# EAGLE design BMS Enerdel Adapter rev8 (EAGLE 9.6.2)
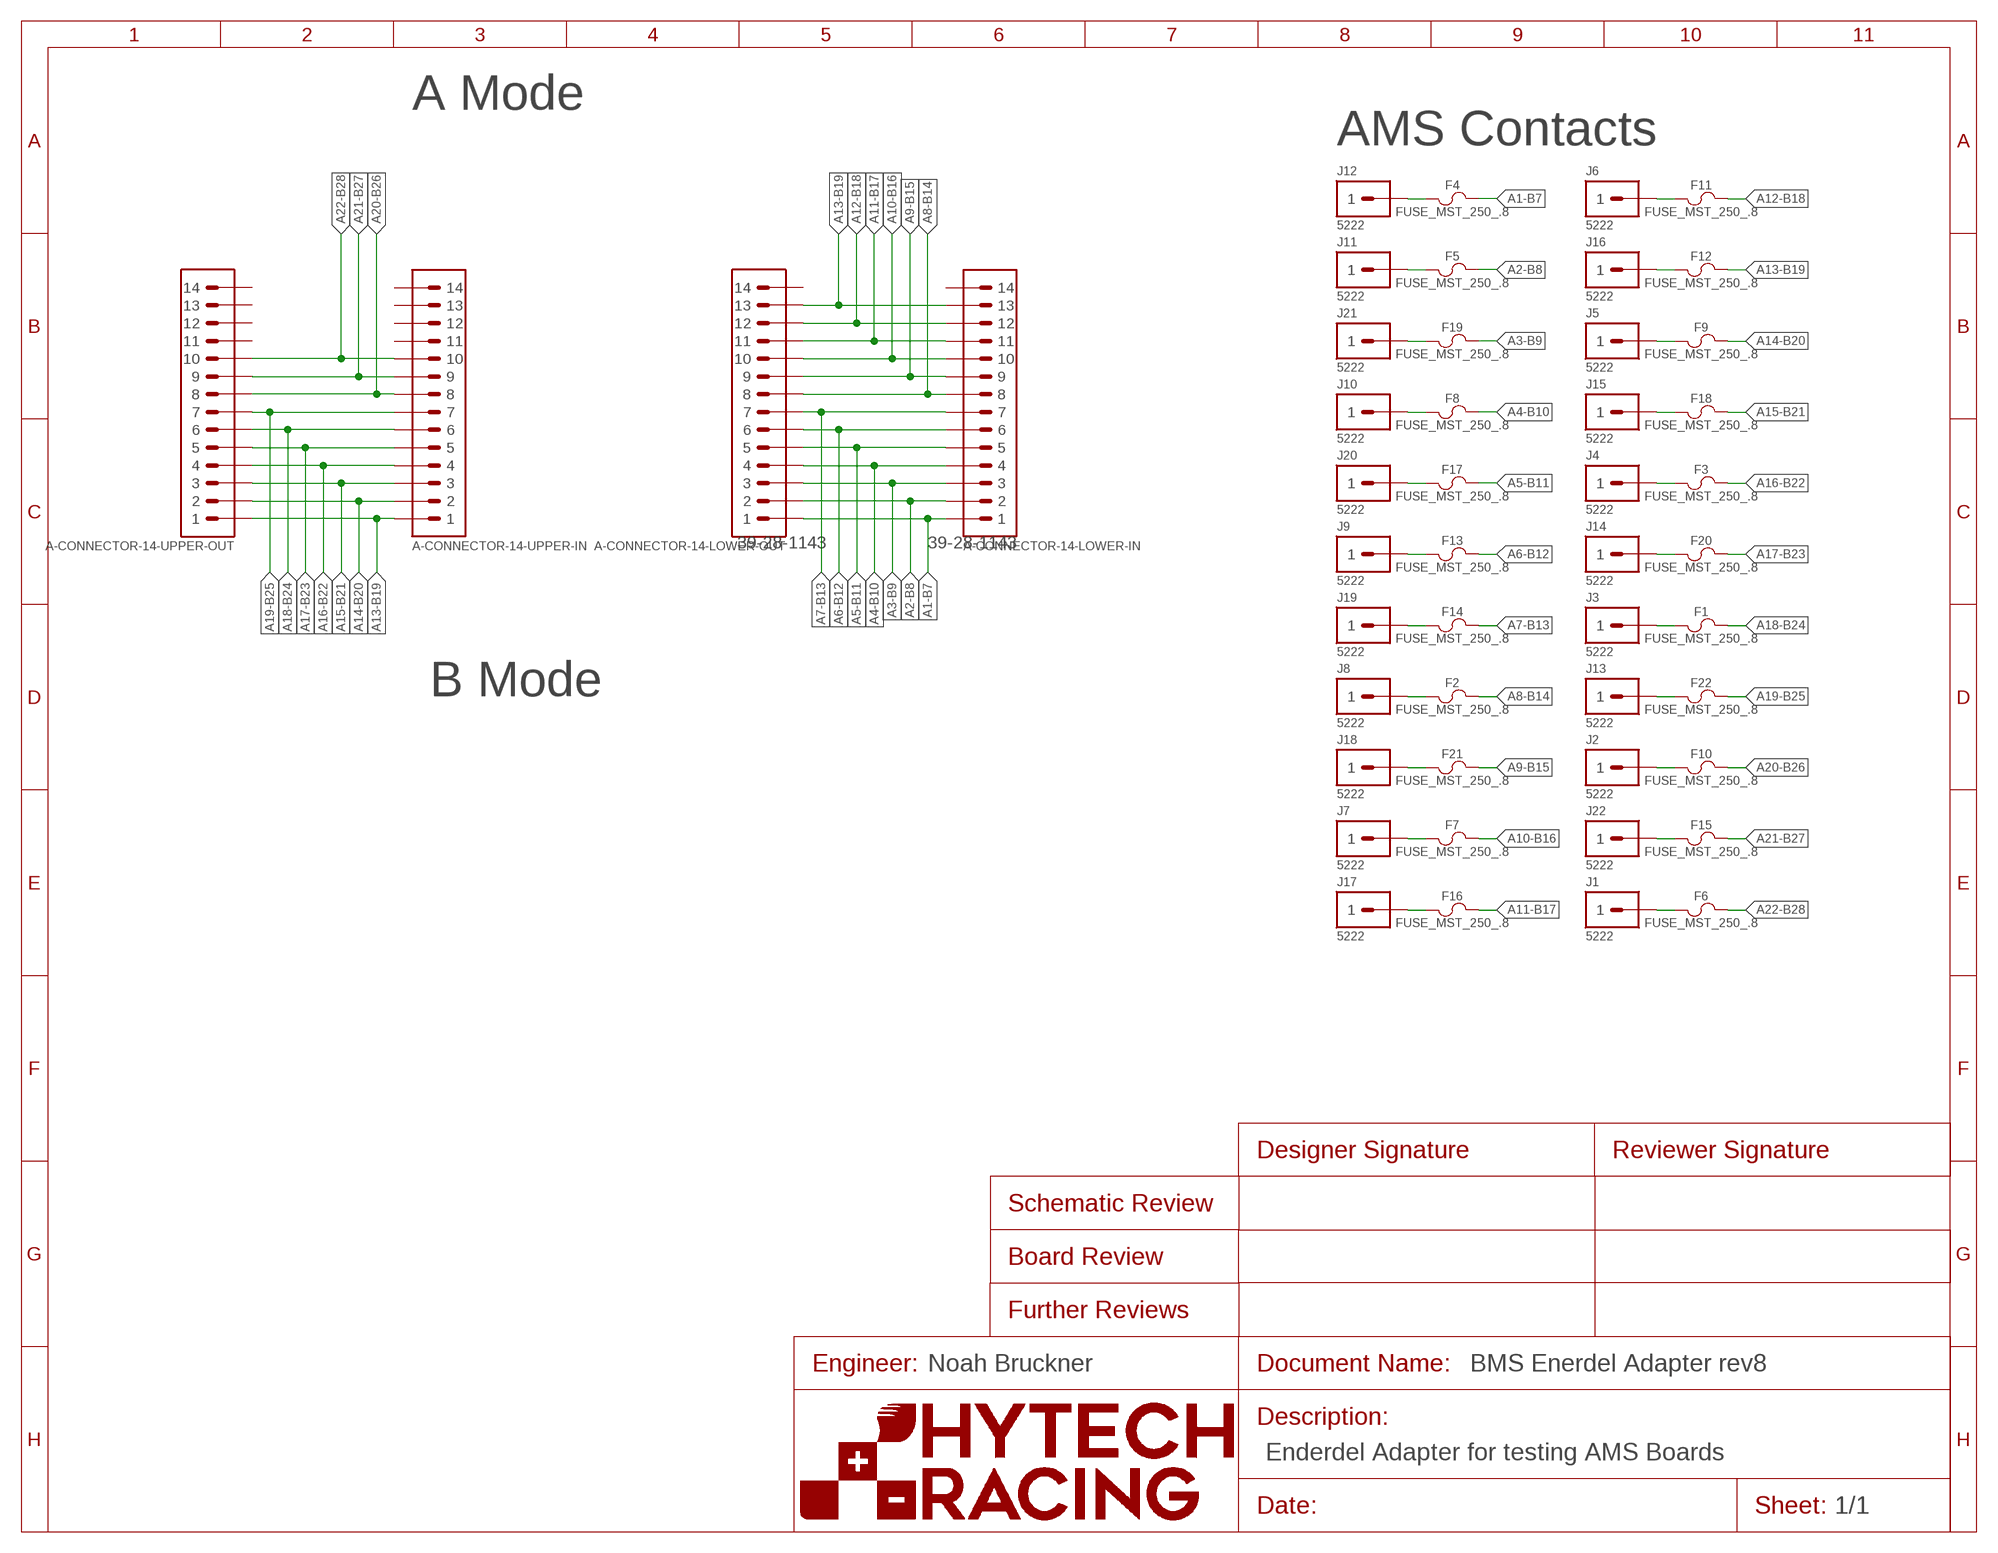
[diagram p0: schematic, sheet 1]

## Parts
A-CONNECTOR-14-LOWER-IN  CONNECTOR-14_MINIFIT_  [MOLEX_MINIFIT_PTH_14]
A-CONNECTOR-14-LOWER-OUT  CONNECTOR-14_MINIFIT_  [MOLEX_MINIFIT_PTH_14]
A-CONNECTOR-14-UPPER-IN  CONNECTOR-14_NANOFIT_  [MOLEX_NANOFIT_PTH_14]
A-CONNECTOR-14-UPPER-OUT  CONNECTOR-14_NANOFIT_  [MOLEX_NANOFIT_PTH_14]
F1  FUSE_MST_250_.8  [MST_250]
F2  FUSE_MST_250_.8  [MST_250]
F3  FUSE_MST_250_.8  [MST_250]
F4  FUSE_MST_250_.8  [MST_250]
F5  FUSE_MST_250_.8  [MST_250]
F6  FUSE_MST_250_.8  [MST_250]
F7  FUSE_MST_250_.8  [MST_250]
F8  FUSE_MST_250_.8  [MST_250]
F9  FUSE_MST_250_.8  [MST_250]
F10  FUSE_MST_250_.8  [MST_250]
F11  FUSE_MST_250_.8  [MST_250]
F12  FUSE_MST_250_.8  [MST_250]
F13  FUSE_MST_250_.8  [MST_250]
F14  FUSE_MST_250_.8  [MST_250]
F15  FUSE_MST_250_.8  [MST_250]
F16  FUSE_MST_250_.8  [MST_250]
F17  FUSE_MST_250_.8  [MST_250]
F18  FUSE_MST_250_.8  [MST_250]
F19  FUSE_MST_250_.8  [MST_250]
F20  FUSE_MST_250_.8  [MST_250]
F21  FUSE_MST_250_.8  [MST_250]
F22  FUSE_MST_250_.8  [MST_250]
J1  CONNECTOR-1_5222_  [5222]
J2  CONNECTOR-1_5222_  [5222]
J3  CONNECTOR-1_5222_  [5222]
J4  CONNECTOR-1_5222_  [5222]
J5  CONNECTOR-1_5222_  [5222]
J6  CONNECTOR-1_5222_  [5222]
J7  CONNECTOR-1_5222_  [5222]
J8  CONNECTOR-1_5222_  [5222]
J9  CONNECTOR-1_5222_  [5222]
J10  CONNECTOR-1_5222_  [5222]
J11  CONNECTOR-1_5222_  [5222]
J12  CONNECTOR-1_5222_  [5222]
J13  CONNECTOR-1_5222_  [5222]
J14  CONNECTOR-1_5222_  [5222]
J15  CONNECTOR-1_5222_  [5222]
J16  CONNECTOR-1_5222_  [5222]
J17  CONNECTOR-1_5222_  [5222]
J18  CONNECTOR-1_5222_  [5222]
J19  CONNECTOR-1_5222_  [5222]
J20  CONNECTOR-1_5222_  [5222]
J21  CONNECTOR-1_5222_  [5222]
J22  CONNECTOR-1_5222_  [5222]

## Nets
A1-B7: A-CONNECTOR-14-LOWER-IN.1 A-CONNECTOR-14-LOWER-OUT.1 F4.2
A2-B8: A-CONNECTOR-14-LOWER-IN.2 A-CONNECTOR-14-LOWER-OUT.2 F5.2
A3-B9: A-CONNECTOR-14-LOWER-IN.3 A-CONNECTOR-14-LOWER-OUT.3 F19.2
A4-B10: A-CONNECTOR-14-LOWER-IN.4 A-CONNECTOR-14-LOWER-OUT.4 F8.2
A5-B11: A-CONNECTOR-14-LOWER-IN.5 A-CONNECTOR-14-LOWER-OUT.5 F17.2
A6-B12: A-CONNECTOR-14-LOWER-IN.6 A-CONNECTOR-14-LOWER-OUT.6 F13.2
A7-B13: A-CONNECTOR-14-LOWER-IN.7 A-CONNECTOR-14-LOWER-OUT.7 F14.2
A8-B14: A-CONNECTOR-14-LOWER-IN.8 A-CONNECTOR-14-LOWER-OUT.8 F2.2
A9-B15: A-CONNECTOR-14-LOWER-IN.9 A-CONNECTOR-14-LOWER-OUT.9 F21.2
A10-B16: A-CONNECTOR-14-LOWER-IN.10 A-CONNECTOR-14-LOWER-OUT.10 F7.2
A11-B17: A-CONNECTOR-14-LOWER-IN.11 A-CONNECTOR-14-LOWER-OUT.11 F16.2
A12-B18: A-CONNECTOR-14-LOWER-IN.12 A-CONNECTOR-14-LOWER-OUT.12 F11.2
A13-B19: A-CONNECTOR-14-LOWER-IN.13 A-CONNECTOR-14-LOWER-OUT.13 A-CONNECTOR-14-UPPER-IN.1 A-CONNECTOR-14-UPPER-OUT.1 F12.2
A14-B20: A-CONNECTOR-14-UPPER-IN.2 A-CONNECTOR-14-UPPER-OUT.2 F9.2
A15-B21: A-CONNECTOR-14-UPPER-IN.3 A-CONNECTOR-14-UPPER-OUT.3 F18.2
A16-B22: A-CONNECTOR-14-UPPER-IN.4 A-CONNECTOR-14-UPPER-OUT.4 F3.2
A17-B23: A-CONNECTOR-14-UPPER-IN.5 A-CONNECTOR-14-UPPER-OUT.5 F20.2
A18-B24: A-CONNECTOR-14-UPPER-IN.6 A-CONNECTOR-14-UPPER-OUT.6 F1.2
A19-B25: A-CONNECTOR-14-UPPER-IN.7 A-CONNECTOR-14-UPPER-OUT.7 F22.2
A20-B26: A-CONNECTOR-14-UPPER-IN.8 A-CONNECTOR-14-UPPER-OUT.8 F10.2
A21-B27: A-CONNECTOR-14-UPPER-IN.9 A-CONNECTOR-14-UPPER-OUT.9 F15.2
A22-B28: A-CONNECTOR-14-UPPER-IN.10 A-CONNECTOR-14-UPPER-OUT.10 F6.2
N$1: F4.1 J12.1
N$2: F5.1 J11.1
N$3: F19.1 J21.1
N$4: F8.1 J10.1
N$8: F17.1 J20.1
N$9: F13.1 J9.1
N$10: F14.1 J19.1
N$11: F2.1 J8.1
N$12: F21.1 J18.1
N$13: F7.1 J7.1
N$14: F16.1 J17.1
N$15: F6.1 J1.1
N$16: F15.1 J22.1
N$17: F10.1 J2.1
N$18: F22.1 J13.1
N$19: F1.1 J3.1
N$20: F20.1 J14.1
N$21: F3.1 J4.1
N$22: F18.1 J15.1
N$23: F9.1 J5.1
N$24: F11.1 J6.1
N$25: F12.1 J16.1
Unconnected: A-CONNECTOR-14-LOWER-IN.14 A-CONNECTOR-14-LOWER-OUT.14 A-CONNECTOR-14-UPPER-IN.11 A-CONNECTOR-14-UPPER-IN.12 A-CONNECTOR-14-UPPER-IN.13 A-CONNECTOR-14-UPPER-IN.14 A-CONNECTOR-14-UPPER-OUT.11 A-CONNECTOR-14-UPPER-OUT.12 A-CONNECTOR-14-UPPER-OUT.13 A-CONNECTOR-14-UPPER-OUT.14

## Notes on the sheet
- A Mode
- AMS Contacts
- B Mode
- Noah Bruckner
- Enderdel Adapter for testing AMS Boards

## Library data of the parts
A-CONNECTOR-14-LOWER-IN A-CONNECTOR-14-LOWER-OUT = HyTechDevices:CONNECTOR-14_?_*; MPN: 39-28-1143
A-CONNECTOR-14-UPPER-IN A-CONNECTOR-14-UPPER-OUT = HyTechDevices:CONNECTOR-14_?_*
F1-F22 = HyTechDevices:FUSE_?_*: Fuse 0885 Series <https://www.mouser.com/datasheet/2/240/Littelfuse_Fuse_885_Datasheet_pdf-1371443.pdf> MST 250 Series <https://www.mouser.com/datasheet/2/358/typ_MST_250-1772502.pdf>; CURRENT: 800mA; DKPN: 486-1470-ND; FUSE_TYPE: THT; MANUFACTURER: Schurter Inc.; MOPN: 693-0034.6614; MPN: 0034.6614; VOLTAGE: 63V
J1-J22 = HyTechDevices:CONNECTOR-1_?_*: 1 Pin Connector Pogo pin datasheet <https://www.mouser.com/datasheet/2/273/Mill-Max_03212019_807-22-001-10-020101-1545127.pdf> 5222 Spring datasheet <https://www.mouser.com/datasheet/2/215/5222-743174.pdf>; DKPN: 36-5222-ND; MANUFACTURER: Keystone Electronics; MODEL: SPRING; MOPN: 534-5222; MPN: 5222

## Board
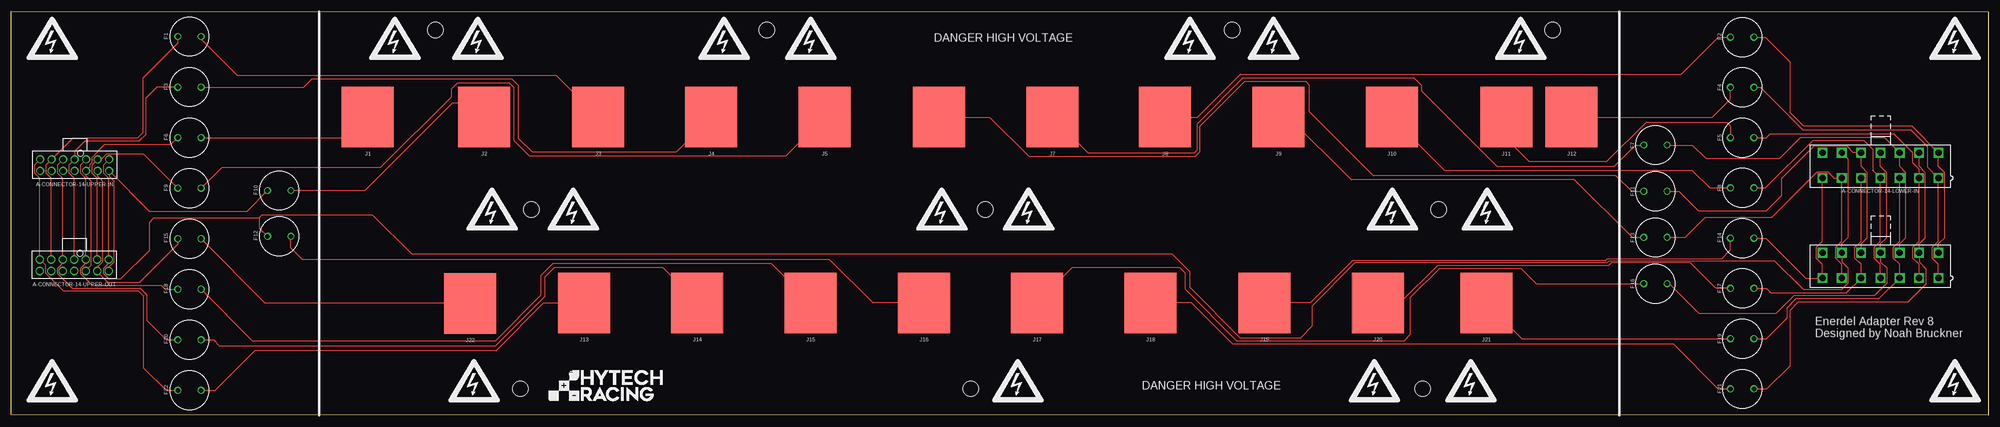
[diagram p1: board, top side]

Size 429.79 x 87.73 mm. Coordinates in mm from the lower left corner, seen from the top.
Outline: 0,0.1 0,87.73 429.79,87.63 429.79,0 0,0.1
Copper layers (1*16): Top 0.035mm / dielectric 1.53mm / Bottom 0.035mm
Design rules "HyTech Default (2 Layer)": minimum track width 8mil, minimum drill 0.3mm, track to track 8mil, track to pad 8mil, pad to pad 8mil, via to via 22mil, smd to smd 8mil, copper to edge 17mil, drill to drill 23mil, minimum pad ring 9mil, minimum via ring 8mil, stop-mask expansion 8mil, vias tented up to drill 30mil, thermal gap 10mil

### Footprints (pad centres in the part's own frame; a part is rotated, then mirrored left to right if it is on the bottom)
MOLEX_MINIFIT_PTH_14 = drill 1.4 square: 1 12.6,-2.75; 2 8.4,-2.75; 3 4.2,-2.75; 4 0,-2.75; 5 -4.2,-2.75; 6 -8.4,-2.75; 7 -12.6,-2.75; 8 12.6,2.75; 9 8.4,2.75; 10 4.2,2.75; 11 0,2.75; 12 -4.2,2.75; 13 -8.4,2.75; 14 -12.6,2.75
MOLEX_NANOFIT_PTH_14 = drill 1.2: 1 7.5,0; 2 5,0; 3 2.5,0; 4 0,0; 5 -2.5,0; 6 -5,0; 7 -7.5,0; 8 7.5,-2.5; 9 5,-2.5; 10 2.5,-2.5; 11 0,-2.5; 12 -2.5,-2.5; 13 -5,-2.5; 14 -7.5,-2.5 | hole 1.3: 1.27,1.34
MST_250 = drill 1: 1 -2.54,0; 2 2.54,0
5222 = smd 11.303 x 13.208: 1 0,0
MOUNTING_M3 = hole 3.4: 0,0

### Placement (x,y rotation side)
A-CONNECTOR-14-LOWER-IN  406.4,54.28 0 top
A-CONNECTOR-14-LOWER-OUT  406.4,32.54 0 top
A-CONNECTOR-14-UPPER-IN  13.74,55.59 0 top
A-CONNECTOR-14-UPPER-OUT  13.64,33.85 0 top
F1  38.7,82.29 180 top
F2  376.34,82.17 0 top
F3  38.7,71.3 180 top
F4  376.34,71.24 0 top
F5  376.34,60.31 0 top
F6  38.7,60.31 180 top
F7  357.48,58.71 0 top
F8  376.34,49.39 0 top
F9  38.7,49.32 180 top
F10  58.22,48.83 180 top
F11  357.48,48.66 0 top
F12  58.22,38.86 180 top
F13  357.48,38.62 0 top
F14  376.34,38.46 0 top
F15  38.7,38.33 180 top
F16  357.48,28.57 0 top
F17  376.34,27.53 0 top
F18  38.7,27.35 180 top
F19  376.34,16.61 0 top
F20  38.7,16.36 180 top
F21  376.34,5.68 0 top
F22  38.7,5.37 180 top
J1  77.5,64.77 180 top
J2  102.77,64.77 180 top
J3  127.53,64.77 180 top
J4  152.17,64.77 180 top
J5  176.81,64.77 180 top
J6  201.7,64.77 180 top
J7  226.34,64.77 180 top
J8  250.85,64.77 180 top
J9  275.49,64.77 180 top
J10  300.13,64.77 180 top
J11  325.02,64.77 180 top
J12  339.24,64.77 180 top
J13  124.49,24.38 180 top
J14  149.12,24.38 180 top
J15  173.76,24.38 180 top
J16  198.4,24.38 180 top
J17  223.04,24.38 180 top
J18  247.68,24.38 180 top
J19  272.44,24.38 180 top
J20  297.08,24.38 180 top
J21  320.7,24.38 180 top
J22  99.72,24.26 180 top
U$1  [HV_LARGE]  8.86,81.9 0 top
U$2  [HV_LARGE]  83.39,81.9 0 top
U$3  [HV_LARGE]  101.42,81.9 0 top
U$4  [HV_LARGE]  154.97,81.9 0 top
U$5  [HV_LARGE]  173.81,81.9 0 top
U$6  [HV_LARGE]  256.29,81.9 0 top
U$7  [HV_LARGE]  274.45,81.9 0 top
U$8  [HV_LARGE]  328.19,81.9 0 top
U$9  [HV_LARGE]  422.63,81.9 0 top
U$10  [HV_LARGE]  104.52,44.76 0 top
U$11  [HV_LARGE]  122.17,44.76 0 top
U$12  [HV_LARGE]  202.31,44.76 0 top
U$13  [HV_LARGE]  221.18,44.76 0 top
U$14  [HV_LARGE]  300.3,44.76 0 top
U$15  [HV_LARGE]  320.93,44.76 0 top
U$16  [MOUNTING_M3]  92.15,83.69 0 top
U$17  [HV_LARGE]  8.86,7.47 0 top
U$18  [HV_LARGE]  100.61,7.47 0 top
U$19  [HV_LARGE]  218.85,7.47 0 top
U$20  [HV_LARGE]  296.39,7.47 0 top
U$21  [HV_LARGE]  317.37,7.47 0 top
U$22  [HV_LARGE]  422.63,7.47 0 top
U$23  [LOGO_HYTECH_1.0"]  116.54,2.78 0 top
U$24  [MOUNTING_M3]  164.24,83.69 0 top
U$25  [MOUNTING_M3]  265.46,83.69 0 top
U$26  [MOUNTING_M3]  335.1,83.69 0 top
U$27  [MOUNTING_M3]  113.06,44.7 0 top
U$28  [MOUNTING_M3]  211.73,44.7 0 top
U$29  [MOUNTING_M3]  310.29,44.7 0 top
U$30  [MOUNTING_M3]  110.64,5.72 0 top
U$31  [MOUNTING_M3]  208.56,5.72 0 top
U$32  [MOUNTING_M3]  306.86,5.72 0 top

### Tracks (layer width: path | path; a pad name or v marks a point on that pad's centre or on a via)
A1-B7
  Top 0.203: A-CONNECTOR-14-LOWER-OUT.1 419,32.76 417.64,34.11 417.64,36.46 419,37.82 A-CONNECTOR-14-LOWER-IN.1 416.66,53.87 416.66,58.32 412.99,61.99 389.51,61.99 380.26,71.24 F4.2
A2-B8
  Top 0.203: A-CONNECTOR-14-LOWER-OUT.2 414.8,32.76 413.44,34.11 413.44,36.46 414.8,37.82 A-CONNECTOR-14-LOWER-IN.2 414.8,53.49 413.44,54.84 413.44,57.04 409.31,61.18 382.45,61.18 381.59,60.31 F5.2
A3-B9
  Top 0.203: A-CONNECTOR-14-LOWER-IN.3 410.6,37.82 409.25,36.46 409.25,34.11 410.6,32.76 A-CONNECTOR-14-LOWER-OUT.3 406.06,25.24 388.01,25.24 386.03,23.26 386.03,21.05 381.59,16.61 F19.2
A4-B10
  Top 0.203: A-CONNECTOR-14-LOWER-OUT.4 406.4,32.76 405.05,34.11 405.05,36.46 406.4,37.82 A-CONNECTOR-14-LOWER-IN.4 404.7,53.23 404.7,57.84 402.87,59.66 391.7,59.66 381.42,49.39 F8.2
A5-B11
  Top 0.203: A-CONNECTOR-14-LOWER-IN.5 402.2,37.82 400.85,36.46 400.85,34.11 402.2,32.76 A-CONNECTOR-14-LOWER-OUT.5 398.98,26.56 382.56,26.56 381.59,27.53 F17.2
A6-B12
  Top 0.203: A-CONNECTOR-14-LOWER-OUT.6 398,32.76 396.64,34.11 396.64,36.46 398,37.82 A-CONNECTOR-14-LOWER-IN.6 396.33,51.53 394.98,52.88 392.62,52.88 382.74,43 368.32,43 363.94,38.62 F13.2
A7-B13
  Top 0.203: A-CONNECTOR-14-LOWER-IN.7 393.8,37.82 392.44,36.46 392.44,34.11 393.8,32.76 A-CONNECTOR-14-LOWER-OUT.7 390.12,29.79 381.44,38.46 F14.2
A8-B14
  Top 0.203: A-CONNECTOR-14-LOWER-OUT.8 419,37.24 420.36,38.6 420.36,52.71 419,54.06 A-CONNECTOR-14-LOWER-IN.8 413.3,62.73 389.79,62.73 386.71,65.81 386.71,76.78 381.33,82.17 F2.2
A9-B15
  Top 0.203: A-CONNECTOR-14-LOWER-IN.9 414.8,54.06 416.15,52.71 416.15,38.6 414.8,37.24 A-CONNECTOR-14-LOWER-OUT.9 414.8,33.33 416.28,31.85 416.28,28.4 412.36,24.48 388.47,24.48 386.69,22.7 386.69,10.66 381.71,5.68 F21.2
A10-B16
  Top 0.203: A-CONNECTOR-14-LOWER-OUT.10 410.6,37.24 411.95,38.6 411.95,52.71 410.6,54.06 A-CONNECTOR-14-LOWER-IN.10 407.2,60.43 389.13,60.43 384.5,55.8 368.45,55.8 365.54,58.71 F7.2
A11-B17
  Top 0.203: A-CONNECTOR-14-LOWER-IN.11 406.4,54.06 407.75,52.71 407.75,38.6 406.4,37.24 A-CONNECTOR-14-LOWER-OUT.11 406.4,33.33 407.75,31.98 407.75,28.61 405.06,25.92 387.55,25.92 383.79,22.15 366.9,22.15 360.49,28.57 F16.2
A12-B18
  Top 0.203: A-CONNECTOR-14-LOWER-OUT.12 402.2,37.24 403.56,38.6 403.56,52.71 402.2,54.06 A-CONNECTOR-14-LOWER-IN.12 400.53,57.03 399.18,58.38 391.91,58.38 384.88,51.35 384.88,47.72 381.58,44.42 366.8,44.42 362.56,48.66 F11.2
A13-B19
  Top 0.203: A-CONNECTOR-14-UPPER-IN.1 20.04,54.38 20.04,52.59 21.14,51.49 A-CONNECTOR-14-UPPER-OUT.1 21.14,33.05 19.93,31.84 19.93,30.85 21.15,29.63 23.79,29.63 30.02,35.86 30.02,41.91 30.96,42.85 41.19,42.85 53.82,42.85 53.87,42.9 | A-CONNECTOR-14-LOWER-IN.13 399.36,55.67 399.36,38.6 398,37.24 A-CONNECTOR-14-LOWER-OUT.13 398,33.33 399.36,31.98 399.36,28.61 397.94,27.2 389.72,27.2 383.32,33.59 347.42,33.59 346.91,33.09 292.15,33.09 282.87,23.8 282.87,19.37 280.34,16.84 267.15,16.84 256.11,27.88 256.11,31.28 252.34,35.05 86.97,35.05 78.46,43.56 54.53,43.56 53.87,42.9 | 53.87,42.9 53.87,40.66 F12.2
A14-B20
  Top 0.203: A-CONNECTOR-14-UPPER-OUT.2 18.64,51.49 17.54,52.59 17.54,54.38 A-CONNECTOR-14-UPPER-IN.2 19.54,55.59 20.74,56.79 28.69,56.79 F9.2
A15-B21
  Top 0.203: A-CONNECTOR-14-UPPER-IN.3 15.04,54.38 15.04,52.59 16.14,51.49 A-CONNECTOR-14-UPPER-OUT.3 16.14,33.05 14.94,31.84 14.94,30.85 17.56,28.22 32.57,28.22 33.43,27.36 36.14,27.36 F18.2
A16-B22
  Top 0.203: A-CONNECTOR-14-UPPER-OUT.4 13.64,51.49 12.54,52.59 12.54,54.38 A-CONNECTOR-14-UPPER-IN.4 13.83,55.67 13.83,57.42 16.02,59.61 27.81,59.61 29.16,60.96 29.16,68.91 31.55,71.3 F3.2
A17-B23
  Top 0.203: A-CONNECTOR-14-UPPER-IN.5 10.04,54.38 10.04,52.59 11.14,51.49 A-CONNECTOR-14-UPPER-OUT.5 11.14,33.05 9.94,31.84 9.94,30.85 13.24,27.54 27.95,27.54 29.38,26.11 29.38,20.59 33.62,16.36 F20.2
A18-B24
  Top 0.203: A-CONNECTOR-14-UPPER-OUT.6 8.64,51.49 7.54,52.59 7.54,54.38 A-CONNECTOR-14-UPPER-IN.6 13.48,60.32 27.44,60.32 28.5,61.38 28.5,73.2 36.16,80.86 F1.2
A19-B25
  Top 0.203: A-CONNECTOR-14-UPPER-IN.7 5.04,54.38 5.04,52.59 6.14,51.49 A-CONNECTOR-14-UPPER-OUT.7 7.43,32.55 7.43,30.85 11.35,26.93 27.63,26.93 28.77,25.79 28.77,10.21 33.62,5.37 F22.2
A20-B26
  Top 0.203: A-CONNECTOR-14-UPPER-OUT.8 21.14,32.14 22.34,33.35 22.34,50.86 21.24,51.96 A-CONNECTOR-14-UPPER-IN.8 29.98,44.35 51.2,44.35 F10.2
A21-B27
  Top 0.203: A-CONNECTOR-14-UPPER-IN.9 18.74,51.96 19.84,50.86 19.84,33.35 18.64,32.14 A-CONNECTOR-14-UPPER-OUT.9 18.64,31.14 20.9,28.88 27.93,28.88 36.16,37.11 F15.2
A22-B28
  Top 0.203: A-CONNECTOR-14-UPPER-OUT.10 17.34,32.55 17.34,50.86 16.24,51.96 A-CONNECTOR-14-UPPER-IN.10 17.13,53.98 17.13,54.55 17.54,54.96 17.54,56.09 20.28,58.83 34.67,58.83 F6.2
N$1
  Top 0.203: J12.1 369.87,64.77 373.8,68.7 F4.1
N$2
  Top 0.203: J11.1 325.02,60.07 330.05,55.04 346.84,55.04 355.5,63.7 372.95,63.7 373.8,62.85 F5.1
N$3
  Top 0.203: J21.1 328.48,16.61 F19.1
N$4
  Top 0.203: J10.1 311.74,53.16 365.51,53.16 369.28,49.39 F8.1
N$8
  Top 0.203: J20.1 301.93,24.38 310.05,32.5 347.24,32.5 347.85,33.11 365.05,33.11 370.63,27.53 F17.1
N$9
  Top 0.203: J9.1 277.72,64.77 291.33,51.16 339.88,51.16 352.42,38.62 F13.1
N$10
  Top 0.203: J19.1 282.41,24.38 291.62,33.59 346.61,33.59 347.04,34.03 371.9,34.03 373.8,35.92 F14.1
N$11
  Top 0.203: J8.1 257.94,64.77 267.24,74.08 363.09,74.08 371.18,82.17 F2.1
N$12
  Top 0.203: J18.1 256.56,24.38 265.61,15.34 361.43,15.34 371.09,5.68 F21.1
N$13
  Top 0.203: J7.1 234.21,56.9 257.07,56.9 257.73,57.56 257.73,63.27 267.77,73.3 304.99,73.3 306.59,71.7 306.59,70.51 322.97,54.13 348.5,54.13 353.08,58.71 F7.1
N$14
  Top 0.203: J17.1 230.66,32 254.08,32 255.29,30.78 255.29,27.3 266.52,16.08 302.74,16.08 304.09,17.42 304.09,25.48 310.46,31.85 328.32,31.85 331.6,28.57 F16.1
N$15
  Top 0.203: F6.1 73.04,60.31 J1.1
N$16
  Top 0.203: J22.1 99.62,24.36 55.21,24.36 F15.1
N$17
  Top 0.203: J2.1 99.8,67.74 95.81,67.74 76.89,48.82 F10.1
N$18
  Top 0.203: J13.1 115.72,24.38 105.37,14.03 52.91,14.03 44.25,5.37 F22.1
N$19
  Top 0.203: J3.1 118.38,73.92 49.06,73.92 41.24,81.75 F1.1
N$20
  Top 0.203: J14.1 149.12,24.64 141.63,32.13 118.11,32.13 116.03,30.05 116.03,25.82 105.31,15.11 45.2,15.11 43.95,16.36 F20.1
N$21
  Top 0.203: J4.1 144.53,57.12 113.28,57.12 110.31,60.1 110.31,71.55 108.86,73 65.24,73 63.54,71.3 F3.1
N$22
  Top 0.203: J15.1 165.18,32.97 117.78,32.97 115.19,30.38 115.19,26.16 105.23,16.21 52.38,16.21 F18.1
N$23
  Top 0.203: J5.1 168.28,56.24 112.7,56.24 109.35,59.59 109.35,71.2 108.25,72.29 97.02,72.29 95.69,70.97 95.69,69.24 80.31,53.86 45.77,53.86 F9.1
N$24
  Top 0.203: J6.1 212.66,64.77 221.22,56.21 257.42,56.21 258.44,57.24 258.44,62.76 268.22,72.54 281.46,72.54 282.17,71.83 282.17,66.05 296.15,52.07 348.92,52.07 352.32,48.66 F11.1
N$25
  Top 0.203: J16.1 187.31,24.38 177.81,33.88 63.19,33.88 60.76,36.32 F12.1

### Text on the board
tPlace: DANGER HIGH VOLTAGE | Enerdel Adapter Rev 8 / Designed by Noah Bruckner | DANGER HIGH VOLTAGE